# Altium project CartReader.PrjPcb
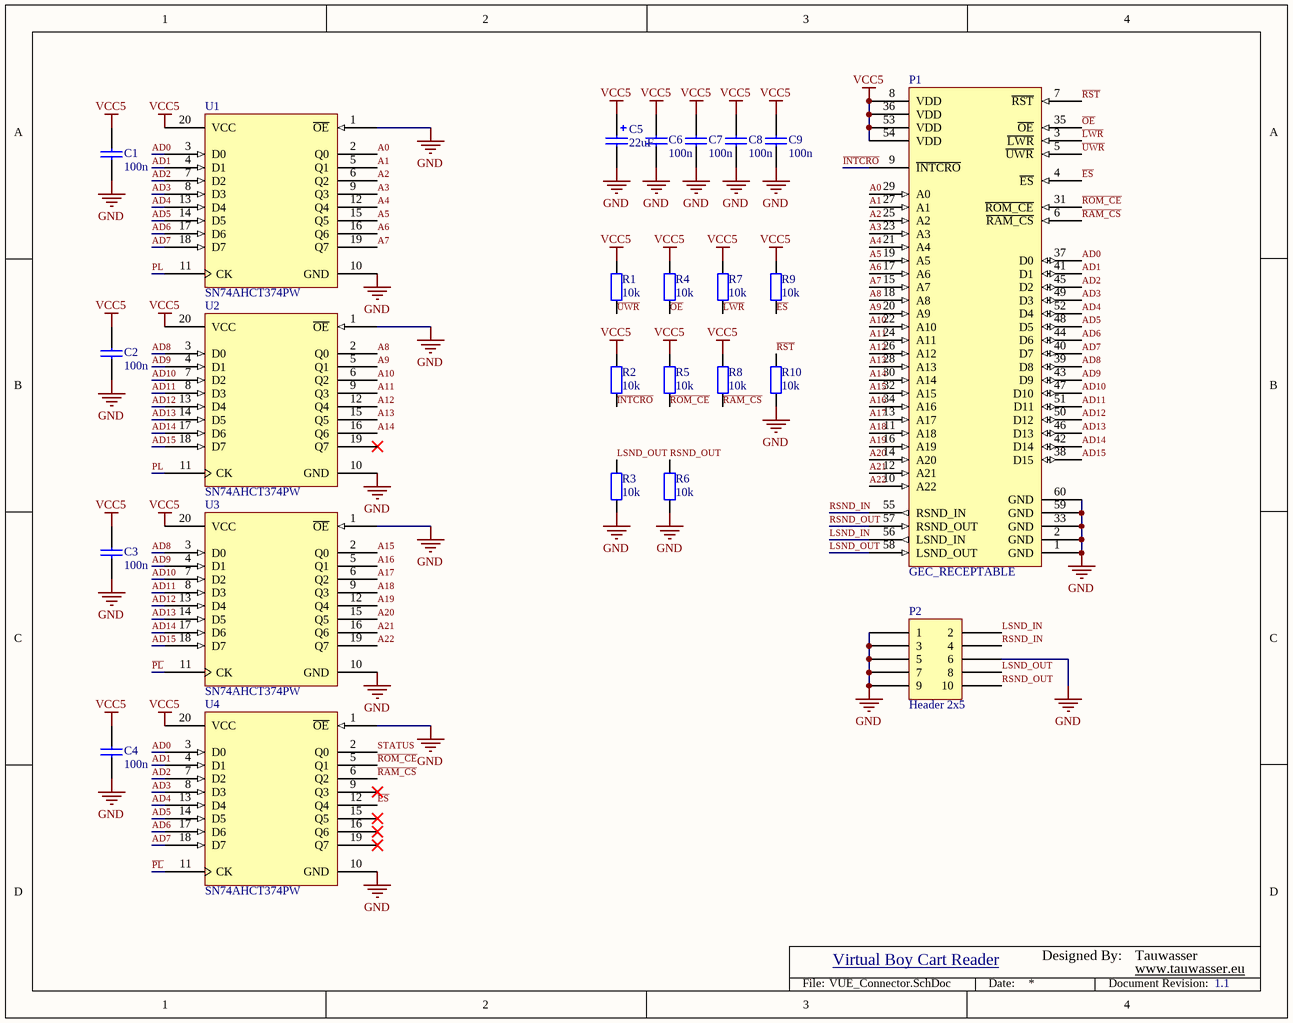
[diagram p0: VUE_Connector.SchDoc]
2 sheets, 61 parts. Net scope: global (net labels, ports and power ports of the same name join across sheets).
Board files: CartReader_1.0.PcbDoc, CartReader_1.1.PcbDoc, CartReader_1.2.PcbDoc, CartReader_1.0_Minimal.PcbDoc, CartReader_1.1_Minimal.PcbDoc, CartReader_1.2_Minimal.PcbDoc
Sheets:
  VUE_Connector.SchDoc
  System.SchDoc

## Sheet VUE_Connector.SchDoc
size A; Revision: 1.1

### Parts
C1  100n  [CAPC1608X90]
C2  100n  [CAPC1608X90]
C3  100n  [CAPC1608X90]
C4  100n  [CAPC1608X90]
C5  22uF  [CAPE66X66]
C6  100n  [CAPC1608X90]
C7  100n  [CAPC1608X90]
C8  100n  [CAPC1608X90]
C9  100n  [CAPC1608X90]
P1  GEC_RECEPTABLE  [GEC_REC]
P2  Header 2x5  [GARRY_WSL-XG-10]
R1  10k  [RESC1608X55]
R2  10k  [RESC1608X55]
R3  10k  [RESC1608X55]
R4  10k  [RESC1608X55]
R5  10k  [RESC1608X55]
R6  10k  [RESC1608X55]
R7  10k  [RESC1608X55]
R8  10k  [RESC1608X55]
R9  10k  [RESC1608X55]
R10  10k  [RESC1608X55]
U1  SN74AHCT374PW  [TSOP65P640X120-20N]
U2  SN74AHCT374PW  [TSOP65P640X120-20N]
U3  SN74AHCT374PW  [TSOP65P640X120-20N]
U4  SN74AHCT374PW  [TSOP65P640X120-20N]

### Nets
GND: C1.1 C2.1 C3.1 C4.1 C5.2 C6.1 C7.1 C8.1 C9.1 P1.1(GND) P1.2(GND) P1.33(GND) P1.59(GND) P1.60(GND) P2.1 P2.3 P2.5 P2.6 P2.7 P2.9 R3.1 R6.1 R10.1 U1.1(~{OE}) U1.10(GND) U2.1(~{OE}) U2.10(GND) U3.1(~{OE}) U3.10(GND) U4.1(~{OE}) U4.10(GND)
VCC5: C1.2 C2.2 C3.2 C4.2 C5.1 C6.2 C7.2 C8.2 C9.2 P1.8(VDD) P1.36(VDD) P1.53(VDD) P1.54(VDD) R1.2 R2.2 R4.2 R5.2 R7.2 R8.2 R9.2 U1.20(VCC) U2.20(VCC) U3.20(VCC) U4.20(VCC)
~{ES}: P1.4(~{ES}) R9.1 U4.12(Q4)
~{INTCRO}: P1.9(~{INTCRO}) R2.1
~{LWR}: P1.3(~{LWR}) R7.1
~{OE}: P1.35(~{OE}) R4.1
~{PL}: U3.11(CK) U4.11(CK)
~{RAM_CS}: P1.6(~{RAM_CS}) R8.1 U4.6(Q2)
~{ROM_CE}: P1.31(~{ROM_CE}) R5.1 U4.5(Q1)
~{RST}: P1.7(~{RST}) R10.2
~{UWR}: P1.5(~{UWR}) R1.1
A0: P1.29(A0) U1.2(Q0)
A1: P1.27(A1) U1.5(Q1)
A2: P1.25(A2) U1.6(Q2)
A3: P1.23(A3) U1.9(Q3)
A4: P1.21(A4) U1.12(Q4)
A5: P1.19(A5) U1.15(Q5)
A6: P1.17(A6) U1.16(Q6)
A7: P1.15(A7) U1.19(Q7)
A8: P1.18(A8) U2.2(Q0)
A9: P1.20(A9) U2.5(Q1)
A10: P1.22(A10) U2.6(Q2)
A11: P1.24(A11) U2.9(Q3)
A12: P1.26(A12) U2.12(Q4)
A13: P1.28(A13) U2.15(Q5)
A14: P1.30(A14) U2.16(Q6)
A15: P1.32(A15) U3.2(Q0)
A16: P1.34(A16) U3.5(Q1)
A17: P1.13(A17) U3.6(Q2)
A18: P1.11(A18) U3.9(Q3)
A19: P1.16(A19) U3.12(Q4)
A20: P1.14(A20) U3.15(Q5)
A21: P1.12(A21) U3.16(Q6)
A22: P1.10(A22) U3.19(Q7)
AD0: P1.37(D0) U1.3(D0) U4.3(D0)
AD1: P1.41(D1) U1.4(D1) U4.4(D1)
AD2: P1.45(D2) U1.7(D2) U4.7(D2)
AD3: P1.49(D3) U1.8(D3) U4.8(D3)
AD4: P1.52(D4) U1.13(D4) U4.13(D4)
AD5: P1.48(D5) U1.14(D5) U4.14(D5)
AD6: P1.44(D6) U1.17(D6) U4.17(D6)
AD7: P1.40(D7) U1.18(D7) U4.18(D7)
AD8: P1.39(D8) U2.3(D0) U3.3(D0)
AD9: P1.43(D9) U2.4(D1) U3.4(D1)
AD10: P1.47(D10) U2.7(D2) U3.7(D2)
AD11: P1.51(D11) U2.8(D3) U3.8(D3)
AD12: P1.50(D12) U2.13(D4) U3.13(D4)
AD13: P1.46(D13) U2.14(D5) U3.14(D5)
AD14: P1.42(D14) U2.17(D6) U3.17(D6)
AD15: P1.38(D15) U2.18(D7) U3.18(D7)
LSND_IN: P1.56(LSND_IN) P2.2
LSND_OUT: P1.58(LSND_OUT) P2.8 R3.2
PL: U1.11(CK) U2.11(CK)
RSND_IN: P1.55(RSND_IN) P2.4
RSND_OUT: P1.57(RSND_OUT) P2.10 R6.2
STATUS: U4.2(Q0)

Not connected (* = marked no-connect by the designer): U2 19(Q7)*; U4 9(Q3)* 15(Q5)* 16(Q6)* 19(Q7)*

### Notes on the sheet
- Virtual Boy Cart Reader
- Designed By:
- Tauwasser
- www.tauwasser.eu
- File:
- Date:
- Document Revision:

### Library data of the parts
C1-C4 C6-C9 = 1168: Ceramic Chip Capacitor; Manufacturer ID: C0603C104K5RACTU; Manufacturer: Kemet; ID: 1168; Type: Standard Ceramic; Voltage: 50V; Characteristic: X7R; Tolerance: ±10%; Value: 100n; Dielectric: Ceramic; Footprint / Size: C0603; Farnell: 1288255; Unit Price: 0; Quantity: 0; ComponentLink1Description: Website; ComponentLink1URL: http://kemet.com/; ComponentLink2Description: Datasheet; ComponentLink2URL: http://www.kemet.com/kemet/web/homepage/kechome.nsf/vapubfiles/F3102_X7R.pdf/$file/F3102_X7R.pdf
C5 = 1001: ID: 1001; Type: Electrolytic Capacitor; Designator: C?; Value: 22uF; ComponentLink1Description: Manufacturer Link; ComponentLink1URL: http://www.jamicon.com/; ComponentLink2Description: Datasheet; ComponentLink2URL: http://www.jamicon.com.tw/media/flash/CapView/assets/pdf/CT.pdf; Footprint: CAPE43X43; Pin Count: 2; Distributor 1: Reichelt; Distributor Number 1: SMD ELKO 22/35
P1 = GEC_RECEPTABLE: VUE GEC_RECEPTABLE
P2 = 2008: Shrouded Header 2x5; ID: 2008; Designator: P?; Type: Shrouded Header; Pin Count: 10; Distributor 1: Reichelt; Distributor Number 1: WSL 10G
R1-R10 = 2471: Resistor; Manufacturer ID: MC 0.063W 0603 1% 10K; Manufacturer: Multicomp; ID: 2471; Element Type: Thick Film; Tolerance: ±1%; Power rating: 0.063W; Temperatur coeff: ±100ppm/°C; Type: Standard; Value: 10k; Footprint / Size: R0603; Farnell: 9330399; Unit Price: 0; Quantity: 0; ComponentLink1Description: Website; ComponentLink2Description: Datasheet; ComponentLink2URL: http://www.farnell.com/datasheets/296742.pdf
U1-U4 = 4003: 8x D Flip Flop w/ OE_N; ID: 4003; Designator: U?; Type: FlipFlop; ComponentLink1Description: Datasheet; ComponentLink1URL: http://www.ti.com/lit/ds/symlink/sn74ahct374.pdf; Distributor 1: Farnell; Distributor Number 1: 1749807; Pin Count: 20

## Sheet System.SchDoc
size A; Revision: 1.2
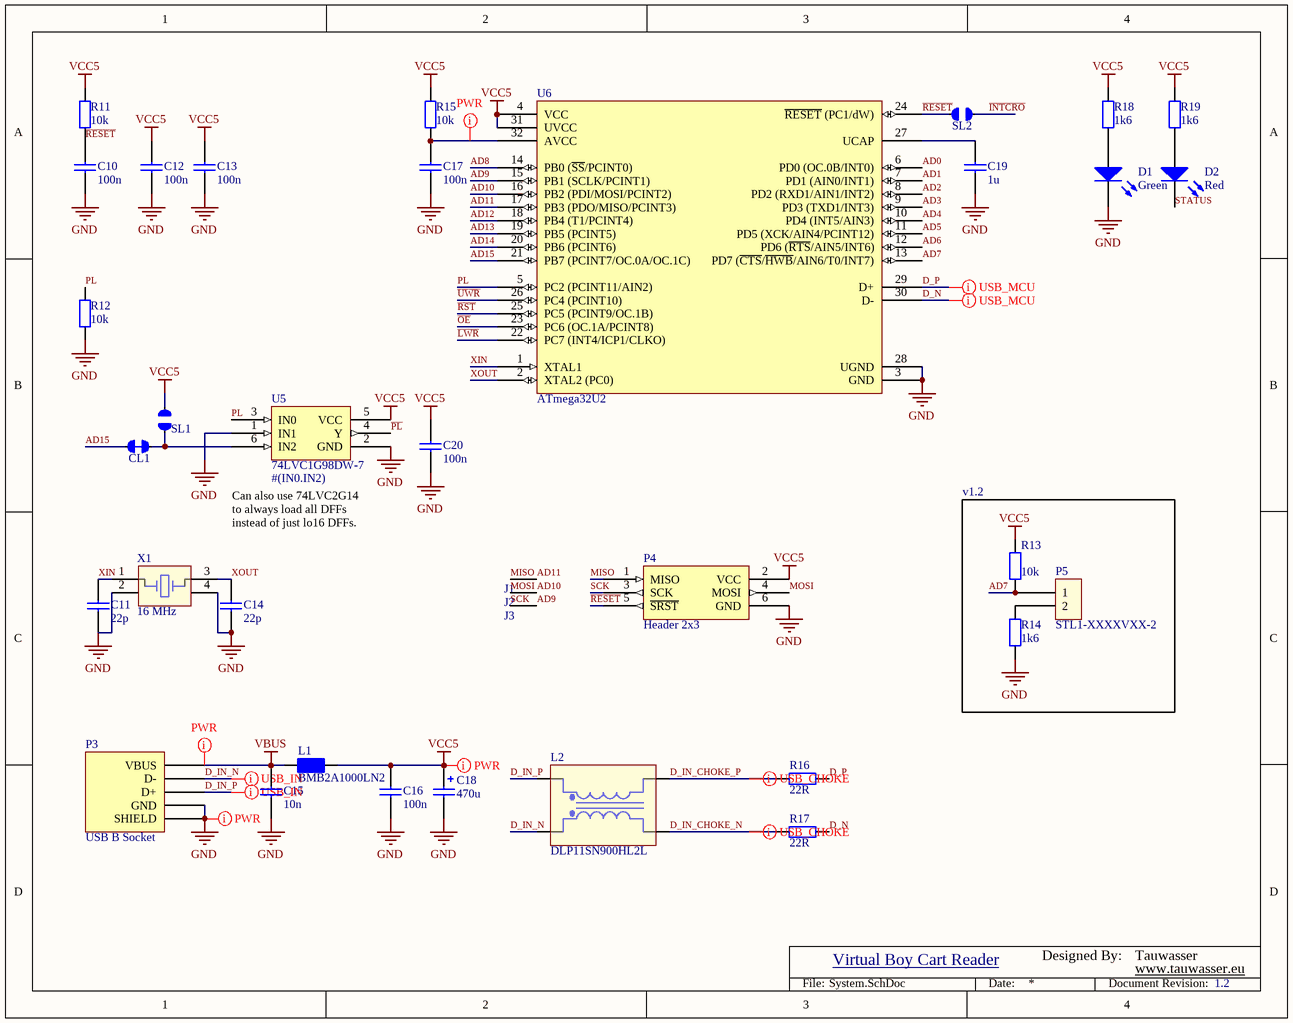
[diagram p1: System.SchDoc]

### Parts
C10  100n  [CAPC1608X90]
C11  22p  [CAPC1608X90]
C12  100n  [CAPC1608X90]
C13  100n  [CAPC1608X90]
C14  22p  [CAPC1608X90]
C15  10n  [CAPC1608X90]
C16  100n  [CAPC1608X90]
C17  100n  [CAPC1608X90]
C18  470u  [CAPAE80X80]
C19  1u  [CAPC1608X90]
C20  100n  [CAPC1608X90]
CL1  Cuttable Link  [CuttableLink]  (value not drawn)  (net tie, no BOM)
D1  value Green  [L-934LX]  (hidden comment: L-934LG)
D2  value Red  [L-934LX]  (hidden comment: L-934LI)
J1  0.2mm  [NETTIE_02MM]  (value not drawn)  (net tie, no BOM)
J2  0.2mm  [NETTIE_02MM]  (value not drawn)  (net tie, no BOM)
J3  0.2mm  [NETTIE_02MM]  (value not drawn)  (net tie, no BOM)
L1  BMB2A1000LN2  [INDC2012X135]
L2  DLP11SN900HL2L  [Choke1210x90]
P3  USB B Socket  [USB_B_SOCKET]
P4  Header 2x3  [GARRY_WSL-XG-6]
P5  STL1-XXXXVXX-2  [GARRY_STL1-XXXXGXX-2]
R11  10k  [RESC1608X55]
R12  10k  [RESC1608X55]
R13  10k  [RESC1608X55]
R14  1k6  [RESC1608X55]
R15  10k  [RESC1608X55]
R16  22R  [RESC1608X55]
R17  22R  [RESC1608X55]
R18  1k6  [RESC1608X55]
R19  1k6  [RESC1608X55]
SL1  Solderable Link  [SolderableLink]  (value not drawn)
SL2  Solderable Link  [SolderableLink]  (value not drawn)
U5  74LVC1G98DW-7  [SOT65P210X110-6N]
U6  ATmega32U2  [TQFP80P900X900X120-32N]
X1  16 MHz  [OSCC700X500X120A]

### Blocks framed on the sheet
v1.2: P5 R13 R14

### Nets
GND: C10.1 C11.1 C12.1 C13.1 C14.1 C15.1 C16.1 C17.1 C18.2 C19.1 C20.1 D1.1(K) P3.0(SHIELD) P3.4(GND) P4.6(GND) R12.1 R14.1 U5.1(IN1) U5.2(GND) U6.3(GND) U6.28(UGND) X1.2(GND) X1.4(GND)
VBUS: C15.2 L1.1 P3.1(VBUS)
VCC5: C12.2 C13.2 C16.2 C18.1 C20.2 L1.2 P4.2(VCC) R11.2 R13.2 R15.2 R18.2 R19.2 SL1.2 U5.5(VCC) U6.4(VCC) U6.31(UVCC)
~{INTCRO}: SL2.1
~{LWR}: U6.22(PC7_(INT4/ICP1/CLKO))
~{OE}: U6.23(PC6_(OC.1A/PCINT8))
~{PL}: U5.4(Y)
~{RESET}: C10.2 P4.5(~{SRST}) R11.1 SL2.2 U6.24(~{RESET}_(PC1/dW))
~{RST}: U6.25(PC5_(PCINT9/OC.1B))
~{UWR}: U6.26(PC4_(PCINT10))
AD0: U6.6(PD0_(OC.0B/INT0))
AD1: U6.7(PD1_(AIN0/INT1))
AD2: U6.8(PD2_(RXD1/AIN1/INT2))
AD3: U6.9(PD3_(TXD1/INT3))
AD4: U6.10(PD4_(INT5/AIN3))
AD5: U6.11(PD5_(XCK/AIN4/PCINT12))
AD6: U6.12(PD6_(~{RTS}/AIN5/INT6))
AD7: P5.1 R13.1 U6.13(PD7_(~{CTS}/~{HWB}/AIN6/T0/INT7))
AD8: U6.14(PB0_(~{SS}/PCINT0))
AD9: J3.2 U6.15(PB1_(SCLK/PCINT1))
AD10: J2.2 U6.16(PB2_(PDI/MOSI/PCINT2))
AD11: J1.2 U6.17(PB3_(PDO/MISO/PCINT3))
AD12: U6.18(PB4_(T1/PCINT4))
AD13: U6.19(PB5_(PCINT5))
AD14: U6.20(PB6_(PCINT6))
AD15: CL1.2 U6.21(PB7_(PCINT7/OC.0A/OC.1C))
D_IN_CHOKE_N: L2.3 R17.2
D_IN_CHOKE_P: L2.2 R16.2
D_IN_N: L2.4 P3.2(D-)
D_IN_P: L2.1 P3.3(D+)
D_N: R17.1 U6.30(D-)
D_P: R16.1 U6.29(D+)
MISO: J1.1 P4.1(MISO)
MOSI: J2.1 P4.4(MOSI)
PL: R12.2 U5.3(IN0) U6.5(PC2_(PCINT11/AIN2))
SCK: J3.1 P4.3(SCK)
STATUS: D2.1(K)
XIN: C11.2 U6.1(XTAL1) X1.1(OSC1)
XOUT: C14.2 U6.2(XTAL2_(PC0)) X1.3(OSC2)
NetC17_2: C17.2 R15.1 U6.32(AVCC)
NetC19_2: C19.2 U6.27(UCAP)
NetCL1_1: CL1.1 SL1.1 U5.6(IN2)
NetD1_2: D1.2(A) R18.1
NetD2_2: D2.2(A) R19.1
NetP5_2: P5.2 R14.2

### Layout directives
differential pair: D_IN_CHOKE_N, D_IN_CHOKE_P, D_IN_N, D_IN_P, D_N, D_P
net class PWR: GND, NetC17_2, VBUS, VCC5

### Notes on the sheet
- (near U5) #(IN0.IN2)
- Can also use 74LVC2G14 to always load all DFFs instead of just lo16 DFFs.
- Virtual Boy Cart Reader
- Designed By:
- Tauwasser
- www.tauwasser.eu
- File:
- Date:
- Document Revision:

### Library data of the parts
C10 C12 C13 C16 C17 C20 = 1168: as C1 on sheet VUE_Connector; Value: 100n; Dielectric: Ceramic; Footprint / Size: C0603; Farnell: 1288255; Unit Price: 0; Quantity: 0; ComponentLink1Description: Website; ComponentLink1URL: http://kemet.com/; ComponentLink2Description: Datasheet; ComponentLink2URL: http://www.kemet.com/kemet/web/homepage/kechome.nsf/vapubfiles/F3102_X7R.pdf/$file/F3102_X7R.pdf
C11 C14 = 1146: Ceramic Chip Capacitor; Manufacturer ID: C0603C220J5GACTU; Manufacturer: Kemet; ID: 1146; Type: Standard Ceramic; Voltage: 50V; Characteristic: NP0; Tolerance: ±10%; Value: 22p; Dielectric: Ceramic; Footprint / Size: C0603; Farnell: 1414622; Unit Price: 0; Quantity: 0; ComponentLink1Description: Website; ComponentLink1URL: http://kemet.com/; ComponentLink2Description: Datasheet; ComponentLink2URL: http://www.kemet.com/kemet/web/homepage/kechome.nsf/vapubfiles/F3102_C0G.pdf/$file/F3102_C0G.pdf
C15 = 1162: Ceramic Chip Capacitor; Manufacturer ID: C0603X103K5RAC; Manufacturer: Kemet; ID: 1162; Type: Standard Ceramic; Voltage: 50V; Characteristic: X7R; Tolerance: ±10%; Value: 10n; Dielectric: Ceramic; Footprint / Size: C0603; Farnell: 1414026; Unit Price: 0; Quantity: 0; ComponentLink1Description: Website; ComponentLink1URL: http://kemet.com/; ComponentLink2Description: Datasheet; ComponentLink2URL: http://www.kemet.com/kemet/web/homepage/kechome.nsf/vapubfiles/F3102_X7R.pdf/$file/F3102_X7R.pdf
C18 = 1210: Aluminum Electrolytic Capacitors; Manufacturer ID: EEEFT1E471AP; Manufacturer: Panasonic; ID: 1210; Type: Standard Electrolytic; Voltage: 25V; Tolerance: ±20%; Value: 470u; Dielectric: Electrolyt; Footprint / Size: C8.3x8.3mm; Farnell: 1868411; Digikey: PCE5010CT-ND; Unit Price: 0; Quantity: 0; ComponentLink1Description: Website; ComponentLink1URL: http://industrial.panasonic.com/; ComponentLink2Description: Datasheet; ComponentLink2URL: http://industrial.panasonic.com/www-data/pdf/ABA0000/ABA0000CE135.pdf
C19 = 1070: Ceramic Chip Capacitor; Manufacturer ID: C0603C105K4PACTU; Manufacturer: Kemet; ID: 1070; Type: Standard Ceramic; Voltage: 16V; Characteristic: X5R; Tolerance: ±10%; Value: 1u; Dielectric: Ceramic; Footprint / Size: C0603; Farnell: 1288256; Digikey: 399-5090-1-ND; Distributor 3: Mouser; Distributor Number 3: 80-C0603C105K4P; Unit Price: 0; Quantity: 0; ComponentLink1Description: Website; ComponentLink1URL: http://kemet.com/; ComponentLink2Description: Datasheet; ComponentLink2URL: http://www.kemet.com/kemet/web/homepage/kechome.nsf/vapubfiles/F3102_X5R.pdf/$file/F3102_X5R.pdf
CL1 = CuttableLink
D1 = 3000: Green Low-Current LED; ID: 3000; Designator: D?; Type: LED; ComponentLink1Description: Manufacturer; ComponentLink1URL: http://www.kingbright.com/; ComponentLink2Description: Datasheet; ComponentLink2URL: http://www.reichelt.de/index.html?;ACTION=7;LA=3;OPEN=0;INDEX=0;FILENAME=A500%252FLED3MM2MAGE_LED3MM2MAGN_LED3MM2MART%2523KIN.pdf; Pin Count: 2; Distributor 1: Reichelt; Distributor Number 1: LED 3MM 2MA GN
D2 = 3002: Red Low-Current LED; ID: 3002; Designator: D?; Type: LED; ComponentLink1Description: Manufacturer; ComponentLink1URL: http://www.kingbright.com/; ComponentLink2Description: Datasheet; ComponentLink2URL: http://www.reichelt.de/index.html?;ACTION=7;LA=3;OPEN=0;INDEX=0;FILENAME=A500%252FLED3MM2MAGE_LED3MM2MAGN_LED3MM2MART%2523KIN.pdf; Pin Count: 2; Distributor 1: Reichelt; Distributor Number 1: LED 3MM 2MA RT
J1-J3 = 6000: ID: 6000; Designator: J?; Pin Count: 2
L1 = 3003: Chip Ferrit Bead Impedanz 1k; Manufacturer: Tyco; ID: 3003; max DC Current: 300mA; Resistance: 300mR; Tolerance: ± 25%; Type: Ferrit Bead; Manufacturer ID: BMB2A1000LN2; Footprint / Size: IND0805; Farnell: 1193421; ComponentLink1Description: Website; ComponentLink1URL: http://www.tycoelectronics.com; ComponentLink2Description: Datasheet
L2 = 3030: SMD Common Mode Choke Coil; Manufacturer: Murata; ID: 3030; max DC Current: 150mA; Resistance: 1.4R; Type: Choke; Manufacturer ID: DLP11SN900HL2L; Footprint / Size: 0504; Digikey: 490-5143-1-ND; Distributor 3: Mouser; Distributor Number 3: 81-DLP11SN900HL2L; ComponentLink1Description: Website; ComponentLink1URL: http://www.murata.com/; ComponentLink2Description: Datasheet; ComponentLink2URL: http://search.murata.co.jp/Ceramy/image/img/w_hinm/L0114E.pdf
P3 = 2000: ID: 2000; Designator: P?; Type: USB; ComponentLink1Description: Datasheet; ComponentLink1URL: http://www.reichelt.de/index.html?;ACTION=7;LA=3;OPEN=0;INDEX=0;FILENAME=C120%252FUSBBW.pdf; Pin Count: 4; Distributor 1: Reichelt; Distributor Number 1: USB BW
P4 = 2005: AVR In-System-Program Header 2x3; ID: 2005; Designator: P?; Type: Program Header; Pin Count: 6; Distributor 1: Reichelt; Distributor Number 1: WSL 6G
P5 = 9605: Header; Manufacturer ID: STL1-XXXXGXX-2; Manufacturer: MPE-Garry; ID: 9605; Value: 1x2; Pitch: 2.54mm; Type: Header; Distributor 3: Reichelt; Distributor Number 3: SL 1X G 2,54; ComponentLink1Description: Website; ComponentLink1URL: http://mpegarry.de/; ComponentLink2Description: Datasheet
R11-R13 R15 = 2471: as R1 on sheet VUE_Connector; Type: Standard; Value: 10k; Footprint / Size: R0603; Farnell: 9330399; Unit Price: 0; Quantity: 0; ComponentLink1Description: Website; ComponentLink2Description: Datasheet; ComponentLink2URL: http://www.farnell.com/datasheets/296742.pdf
R14 R18 R19 = 2452: Resistor; Manufacturer ID: MC 0.063W 0603 1% 1K6; Manufacturer: Multicomp; ID: 2452; Element Type: Thick Film; Tolerance: ±1%; Power rating: 0.063W; Temperatur coeff: ±100ppm/°C; Type: Standard; Value: 1k6; Footprint / Size: R0603; Farnell: 9330666; Unit Price: 0; Quantity: 0; ComponentLink1Description: Website; ComponentLink2Description: Datasheet; ComponentLink2URL: http://www.farnell.com/datasheets/296742.pdf
R16 R17 = 2407: Resistor; Manufacturer ID: MC 0.063W 0603 1% 22R; Manufacturer: Multicomp; ID: 2407; Element Type: Thick Film; Tolerance: ±1%; Power rating: 0.063W; Temperatur coeff: ±200ppm/°C; Type: Standard; Value: 22R; Footprint / Size: R0603; Farnell: 9330844; Unit Price: 0; Quantity: 0; ComponentLink1Description: Website; ComponentLink2Description: Datasheet; ComponentLink2URL: http://www.farnell.com/datasheets/296742.pdf
SL1 SL2 = SolderableLink
U5 = 4004: Configurable Multi-Function Logic Gate; ID: 4004; Designator: U?; Type: Logic; ComponentLink1Description: Datasheet; ComponentLink1URL: http://www.diodes.com/datasheets/74LVC1G98.pdf; Footprint: SOT-363; Pin Count: 6; Distributor 1: Farnell; Distributor Number 1: 1893843
U6 = 4001: 8-Bit AVR MCU,32KB Flash,USB Contr.,TQFP-32; ID: 4001; Designator: U?; Type: Microcontroller; ComponentLink1Description: Datasheet; ComponentLink1URL: http://www.atmel.com/Images/doc7799.pdf; Pin Count: 32; Distributor 1: Reichelt; Distributor Number 1: ATmega 32-U2
X1 = 8000: ID: 8000; Designator: X?; Value: 16.000 MHz; Type: Ceramic; ComponentLink1Description: Datasheet; ComponentLink1URL: http://www.reichelt.de/index.html?;ACTION=7;LA=3;OPEN=0;INDEX=0;FILENAME=B400%252FMQ.pdf; Distributor 1: Reichelt; Distributor Number 1: 16,000000-MQ

## Nets that join several sheets
GND: VUE_Connector (31 pins), System (23 pins)
VCC5: VUE_Connector (24 pins), System (16 pins)
~{INTCRO}: VUE_Connector (P1.9 R2.1), System (SL2.1)
~{LWR}: VUE_Connector (P1.3 R7.1), System (U6.22)
~{OE}: VUE_Connector (P1.35 R4.1), System (U6.23)
~{PL}: VUE_Connector (U3.11 U4.11), System (U5.4)
~{RST}: VUE_Connector (P1.7 R10.2), System (U6.25)
~{UWR}: VUE_Connector (P1.5 R1.1), System (U6.26)
AD0: VUE_Connector (P1.37 U1.3 U4.3), System (U6.6)
AD1: VUE_Connector (P1.41 U1.4 U4.4), System (U6.7)
AD2: VUE_Connector (P1.45 U1.7 U4.7), System (U6.8)
AD3: VUE_Connector (P1.49 U1.8 U4.8), System (U6.9)
AD4: VUE_Connector (P1.52 U1.13 U4.13), System (U6.10)
AD5: VUE_Connector (P1.48 U1.14 U4.14), System (U6.11)
AD6: VUE_Connector (P1.44 U1.17 U4.17), System (U6.12)
AD7: VUE_Connector (P1.40 U1.18 U4.18), System (P5.1 R13.1 U6.13)
AD8: VUE_Connector (P1.39 U2.3 U3.3), System (U6.14)
AD9: VUE_Connector (P1.43 U2.4 U3.4), System (J3.2 U6.15)
AD10: VUE_Connector (P1.47 U2.7 U3.7), System (J2.2 U6.16)
AD11: VUE_Connector (P1.51 U2.8 U3.8), System (J1.2 U6.17)
AD12: VUE_Connector (P1.50 U2.13 U3.13), System (U6.18)
AD13: VUE_Connector (P1.46 U2.14 U3.14), System (U6.19)
AD14: VUE_Connector (P1.42 U2.17 U3.17), System (U6.20)
AD15: VUE_Connector (P1.38 U2.18 U3.18), System (CL1.2 U6.21)
PL: VUE_Connector (U1.11 U2.11), System (R12.2 U5.3 U6.5)
STATUS: VUE_Connector (U4.2), System (D2.1)

## Assembly variants
Minimal: not fitted C10 L1 L2 P2 P5 R1 R2 R3 R4 R5 R6 R7 R8 R9 R10 R12 R14